# Altium schematic sheet HT-TRS-Interface-Schematic.SchDoc: HT- Sound Card Interface for Echolink
size A4; Author: 4S6TMP; CompanyName: 4S6TMP; DrawnBy: 4S6TMP; Engineer: 4S6TMP; Organization: 4S6TMP; Address1: Sri Lanka; Revision: 1; SheetNumber: 1; SheetTotal: 1
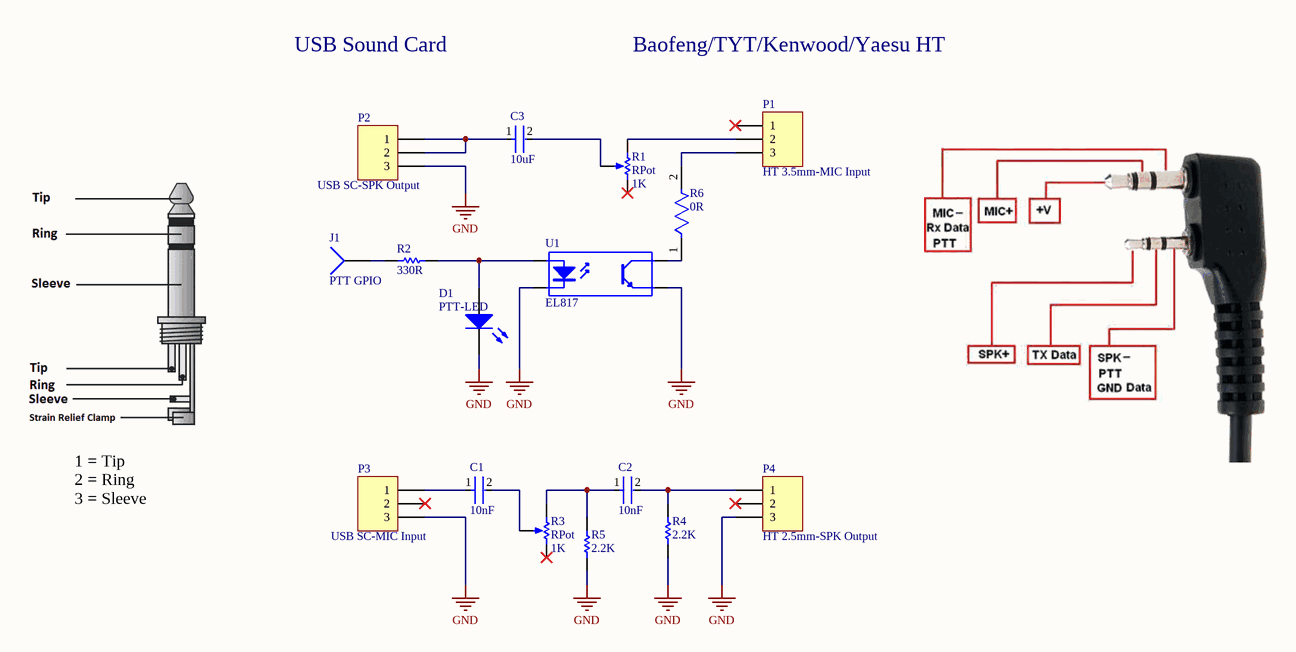
[diagram p0: HT-TRS-Interface-Schematic.SchDoc]

## Parts
C1  10nF  [FP-CC0603-DA-MFG]
C2  10nF  [FP-CC0603-DA-MFG]
C3  10uF  [FP-C1608-MFG]
D1  PTT-LED  [3.2X1.6X1.1]
J1  PTT GPIO  [PIN1]
P1  HT 3.5mm-MIC Input  [MHDR1X3]  (net tie, no BOM)
P2  USB SC-SPK Output  [MHDR1X3]  (net tie, no BOM)
P3  USB SC-MIC Input  [MHDR1X3]  (net tie, no BOM)
P4  HT 2.5mm-SPK Output  [MHDR1X3]  (net tie, no BOM)
R1  RPot  value 1K  [VR5]
R2  330R  [RESC1608X55X30LL15T15]
R3  RPot  value 1K  [VR5]
R4  2.2K  [RESC1608X55X30ML20T20]
R5  2.2K  [RESC1608X55X30ML20T20]
R6  0R  [FP-ERJ-3GEY0R00V-MFG]
U1  EL817  [DIP-4]

## Nets
GND: D1.2(K) P2.3 P3.3 P4.3 R4.1 R5.1 U1.2(K) U1.3(E)
NetC1_1: C1.1 P3.1
NetC1_2: C1.2 R3.3(TAP)
NetC2_1: C2.1 R3.1(TOP) R5.2
NetC2_2: C2.2 P4.1 R4.2
NetC3_1: C3.1 P2.1 P2.2
NetC3_2: C3.2 R1.3(TAP)
NetD1_1: D1.1(A) R2.2 U1.1(A)
NetJ1_1: J1.1 R2.1
NetP1_2: P1.2 R1.1(TOP)
NetP1_3: P1.3 R6.2
NetR6_1: R6.1 U1.4(C)

Not connected (* = marked no-connect by the designer): P1 1*; P3 2*; P4 2*; R1 2(BOT)*; R3 2(BOT)*

## Notes on the sheet
- USB Sound Card
- Baofeng/TYT/Kenwood/Yaesu HT
- 1 = Tip
  2 = Ring
  3 = Sleeve
- Title
- Size:
- Date:
- A4
- Number:
- Time:
- Revision:
- Sheet
- of
- File:

## Library data of the parts
C1 C2 = CMP-03422-000327-1: CAP CER 10000PF 25V X7R 0603; Manufacturer: YAGEO; Manufacturer Part Number: CC0603KRX7R8BB103; Tolerance: 0.1; Temperature Coefficient: 15%; Material: Ceramic; Lead Free: Yes; Value: 10 nF; Temperature Range Low: -55°C; Mouser Description: Multilayer Ceramic Capacitors MLCC - SMD/SMT 10nF 25V X7R 10%; Device Class L1: Passive Components; RoHS: TRUE; Digikey Description: CAP CER 10000PF 25V X7R 0603; Capacitance: 10 nF; Temperature: -55°C to +125°C; Footprint Url: http://www.yageo.com/exep/pages/download/literatures/UPY-C_GEN_24.pdf; Category: Cap; ComponentLink2URL: http://www.yageo.com/documents/recent/UPY-GPHC_X7R_6.3V-to-50V_18.pdf; Octopart: https://octopart.com/cc0603krx7r8bb103-yageo-9288195; Temperature Characteristic: X7R; ComponentLink2Description: Datasheet; Voltage Rating: 25 V; Package: CC0603-DA; Automotive: No; Voltage: 25 V; Device Class L3: Ceramic Capacitors; Device Class L2: Capacitors; Temperature Range High: +125°C; Height: 0.9mm
C3 = CMP-08246-000019-1: CAP CER 10UF 16V X5R 0603; Manufacturer: TDK Corporation; Manufacturer Part Number: C1608X5R1C106M080AB; Temperature Coefficient: 15%; Tolerance: 20%; Material: Ceramic; Octopart: https://octopart.com/c1608x5r1c106m080ab-tdk-26013480; ComponentLink2Description: Datasheet; Value: 10uF; Temperature Range Low: -55°C; Digikey Description: CAP CER 10UF 16V X5R 0603; Package: C1608; Lead Free: Yes; Mouser Description: Multilayer Ceramic Capacitors MLCC - SMD/SMT 0603 10uF 16volts X5R +/-20% GP; Device Class L2: Capacitors; Voltage Rating: 16V; RoHS: TRUE; Automotive: No; Height: 0.9mm; Ipc Land Pattern Name: CAPC16080X80; ComponentLink2URL: https://upverter.com/datasheet/6fbac97fd59b4a24a005814037d2a36a27db40e9.pdf; Temperature Range High: +85°C; Capacitance: 10uF; Temperature: -55°C to +85°C; Category: Cap; Device Class L1: Passive Components; Device Class L3: Ceramic Capacitors; Temperature Characteristic: X5R
D1 = LED2: Typical RED, GREEN, YELLOW, AMBER GaAs LED; Published: 8-Jun-2000; LatestRevisionDate: 17-Jul-2002; LatestRevisionNote: Re-released for DXP Platform.; PackageVersion: Feb-2002; PackageReference: 3.2X1.6X1.1; Publisher: Altium Limited; PackageDescription: SM LED; 2 Flat Leads
J1 = Socket: LatestRevisionDate: 17-Jul-2002; LatestRevisionNote: Re-released for DXP Platform.; Publisher: Altium Limited
P1-P4 = MHDR1X3: Header, 3-Pin; LatestRevisionDate: 17-Jul-2002; LatestRevisionNote: Re-released for DXP Platform.; Publisher: Altium Limited
R1 R3 = RPot: Potentiometer; Sim Note: Enter the Resistance value and the set point into parameter fields.; Set Position: 0.5; Published: 8-Jun-2000; LatestRevisionDate: 17-Jul-2002; LatestRevisionNote: Re-released for DXP Platform.; PackageReference: VR5; Publisher: Altium Limited; PackageDescription: Variable Resistor, Thru-Hole; 3 Leads
R2 = CMP-2000-00435-2: Chip Resistor, 330 Ohm, +/- 1%, 0.1 W, -55 to 155 degC, 0603 (1608 Metric), RoHS, Tape and Reel; Gender: Male; Mating Cycles: 10000; Current Rating: 500 mA; Voltage Rating: 10 V; REACH SVHC: No SVHC; PackageDescription: 2-Pin Surface Mount Device, Body 1.6 x 0.85 mm; Contact Finish: Gold; Pins: 8; ComponentLink1Description: Manufacturer URL; Packaging: Tape and Reel; Max Operating Temperature: 85 degC; Contact Material: Copper; Height: 1.45 mm; Width: 1.45 mm; DatasheetVersion: Apr-15; Package Quantity: 1500; Contact Plating: Gold; PackageReference: 0603; Mount: Surface Mount; Lead Pitch: 1.1 mm; Min Operating Temperature: -25 degC; ComponentLink1URL: http://www.panasonic.com/; ComponentLink2URL: http://industrial.panasonic.com/cdbs/www-data/pdf/RDA0000/AOA0000C86.pdf; Length: 13.7 mm; ComponentLink2Description: Datasheet; RoHSCompliant: true
R4 R5 = CMP-2000-00955-1: Manufacturer: Panasonic; Part Number: ERA3AEB222V
R6 = CMP-2000-00700-2: RES SMD 0 OHM JUMPER 1/10W 0603; Manufacturer Part Number: ERJ-3GEY0R00V; Manufacturer: Panasonic; Tolerance: 5%; Automotive Grade: Grade 0; Voltage Rating: 75V; Value: 0Ω; Temperature Coefficient: -100/+600ppm/°C; Power Rating: 0.1W; Mouser Description: Resistor, Chip Thick Film, 0 Ohm, 0.1w, Resistor, Chip Thick Film, 0 Ohm, 0.1w, 5%; Ipc Land Pattern Name: RESC16080X45; Category: Res; Package: 0603; Temperature: -55°C to +155°C; Temperature Range Low: -55°C; Series: ERJ; Resistance: 0Ω; RoHS: TRUE; Composition: Thick Film; Octopart: https://octopart.com/erj-3gey0r00v-panasonic-55389238; Device Class L1: Passive Components; Footprint Url: https://industrial.panasonic.com/cdbs/www-data/pdf/RDA0000/DMA0000COL17.pdf; ComponentLink2Description: Datasheet; Device Class L2: Resistors; Temperature Range High: +155°C; Digikey Description: RES SMD 0 OHM JUMPER 1/10W 0603; Lead Free: Yes; Device Class L3: Chip SMD Resistors; Height: 0.55mm; ComponentLink2URL: https://industrial.panasonic.com/cdbs/www-data/pdf/RDA0000/AOA0000C301.pdf; Automotive: Yes
U1 = Optoisolator1: 4-Pin Phototransistor Optocoupler; Published: 24-Mar-1999; LatestRevisionDate: 04-Mar-2005; LatestRevisionNote: Sch pins 3 & 4 Swapped.; DatasheetVersion: Nov-2003; PackageReference: DIP-4; Publisher: Altium Limited